# Altium project ST25RU3993_RF_MODULE.PrjPcb (part 4 of 4)
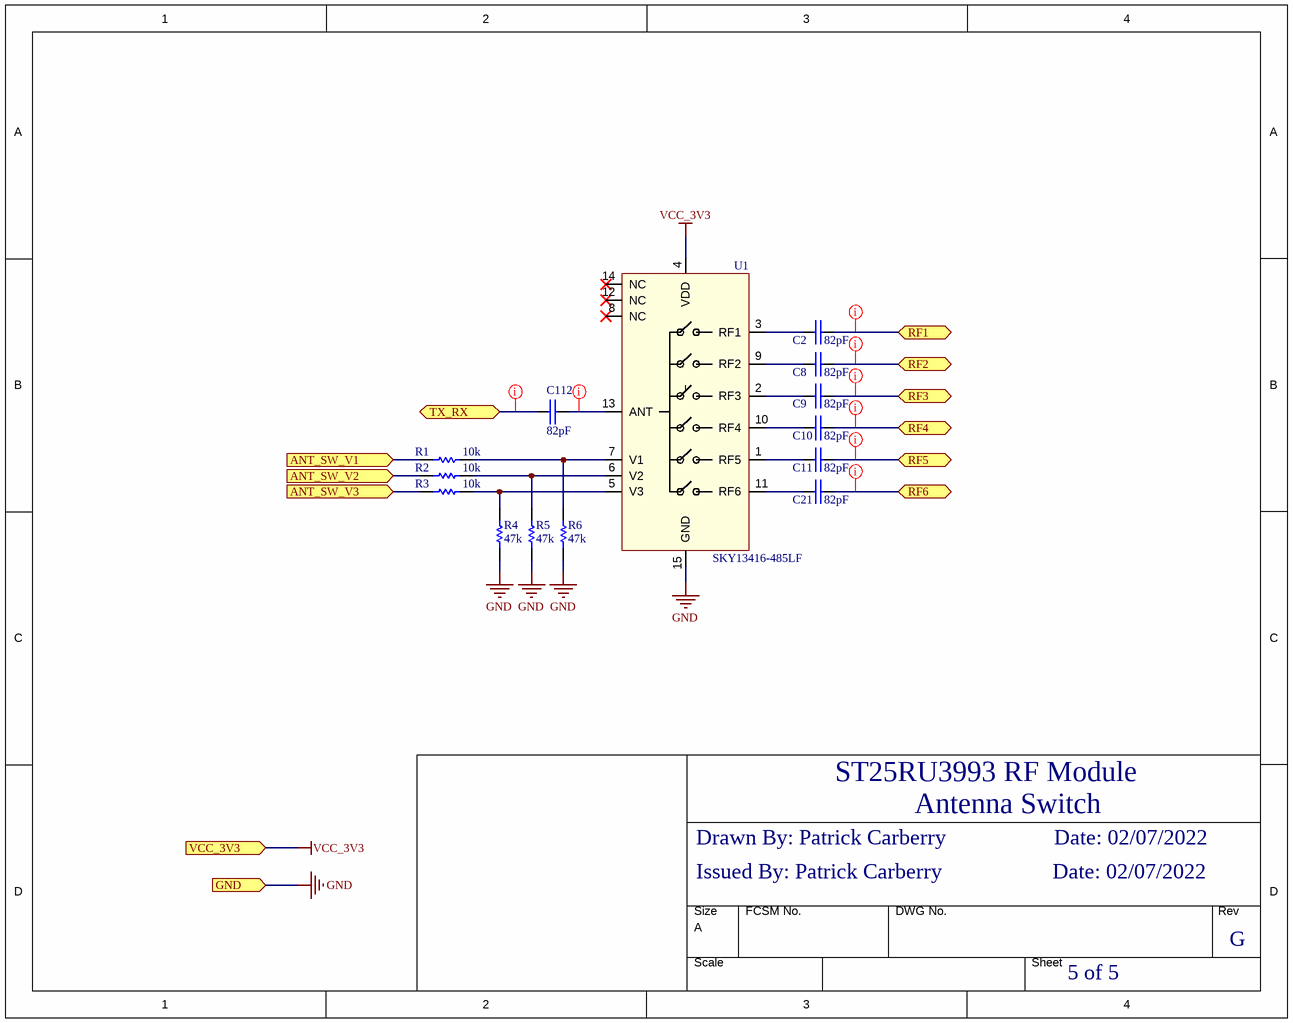
[diagram p5: Antenna_Switch_HP.SchDoc]

## Nets that join several sheets
GND: System_Overview_HP (38 pins), UHF_RFID_HP (57 pins), Power_Amplifier_HP (33 pins), Carrier_Cancellation_HP (26 pins), Antenna_Switch_HP (R4.1 R5.1 R6.1 U1.15)
VCC_3V3: System_Overview_HP (11.1), UHF_RFID_HP (C50.1 C69.1 FB4.1 U5.38), Power_Amplifier_HP (C15.1 C70.1 U3.2 U3.8), Carrier_Cancellation_HP (9 pins), Antenna_Switch_HP (U1.4)
VPA_4V1: System_Overview_HP (12.1), Power_Amplifier_HP (C16.3 C20.1 C104.1)
VSUP_3V6: System_Overview_HP (13.1), UHF_RFID_HP (C91.3 C92.1)
ADC: System_Overview_HP (16.1), UHF_RFID_HP (U5.39)
ANT_SW_V1: System_Overview_HP (26.1), Antenna_Switch_HP (R1.1)
ANT_SW_V2: System_Overview_HP (27.1), Antenna_Switch_HP (R2.1)
ANT_SW_V3: System_Overview_HP (28.1), Antenna_Switch_HP (R3.1)
CLK: System_Overview_HP (29.1), UHF_RFID_HP (U5.37), Carrier_Cancellation_HP (U6.5 U7.5 U8.5)
EN: System_Overview_HP (32.1), UHF_RFID_HP (U5.31)
ETC_1: System_Overview_HP (35.1), Carrier_Cancellation_HP (U6.6)
ETC_2: System_Overview_HP (36.1), Carrier_Cancellation_HP (U7.6)
ETC_3: System_Overview_HP (37.1), Carrier_Cancellation_HP (U8.6)
IRQ: System_Overview_HP (33.1), UHF_RFID_HP (U5.32)
MISO: System_Overview_HP (30.1), UHF_RFID_HP (U5.34)
MOSI: System_Overview_HP (31.1), UHF_RFID_HP (U5.35), Carrier_Cancellation_HP (U6.7 U7.7 U8.7)
NCS: System_Overview_HP (23.1), UHF_RFID_HP (U5.33)
NetANT1_IN: System_Overview_HP (ANT1.IN), Antenna_Switch_HP (C11.2)
NetANT2_IN: System_Overview_HP (ANT2.IN), Antenna_Switch_HP (C9.2)
NetANT3_IN: System_Overview_HP (ANT3.IN), Antenna_Switch_HP (C2.2)
NetANT4_IN: System_Overview_HP (ANT4.IN), Antenna_Switch_HP (C21.2)
NetANT5_IN: System_Overview_HP (ANT5.IN), Antenna_Switch_HP (C10.2)
NetANT6_IN: System_Overview_HP (ANT6.IN), Antenna_Switch_HP (C8.2)
NetC107_1: UHF_RFID_HP (J9.OUT), Power_Amplifier_HP (C107.1)
NetC112_2: Carrier_Cancellation_HP (T4.6), Antenna_Switch_HP (C112.2)
NetJ1_IN: UHF_RFID_HP (T5.1), Power_Amplifier_HP (J1.IN)
NetT2_1: Power_Amplifier_HP (T2.1), Carrier_Cancellation_HP (T4.1)
OAD: System_Overview_HP (15.1), UHF_RFID_HP (U5.27)
OAD2: System_Overview_HP (14.1), UHF_RFID_HP (U5.26)
PA_SW_V1: System_Overview_HP (25.1), Power_Amplifier_HP (S1.1)
PA_SW_V2: System_Overview_HP (24.1), Power_Amplifier_HP (S1.3)
RF_DETECTOR: System_Overview_HP (22.1), Power_Amplifier_HP (U3.7)
RX_N: UHF_RFID_HP (C94.1), Carrier_Cancellation_HP (T6.3)
RX_P: UHF_RFID_HP (C93.1), Carrier_Cancellation_HP (T6.4)
VCO: System_Overview_HP (34.1), UHF_RFID_HP (C55.1 R33.1)